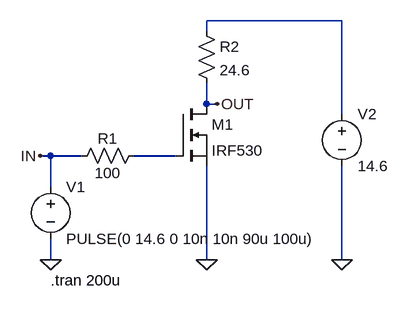
[diagram p0: schematic praca impulsowa e-mosfet.asc]
praca impulsowa e-mosfet.asc, the LTspice schematic file:
Version 4.1
SHEET 1 880 680
WIRE 416 -32 208 -32
WIRE 208 -16 208 -32
WIRE 208 96 208 64
WIRE 224 96 208 96
WIRE 416 112 416 -32
WIRE -32 176 -48 176
WIRE 16 176 -32 176
WIRE 160 176 96 176
WIRE -32 224 -32 176
WIRE -32 336 -32 304
WIRE 208 336 208 192
WIRE 416 336 416 192
FLAG 208 336 0
FLAG -32 336 0
FLAG 416 336 0
FLAG -48 176 IN
FLAG 224 96 OUT
SYMBOL nmos 160 96 R0
SYMATTR InstName M1
SYMATTR Value IRF530
SYMBOL voltage -32 208 R0
WINDOW 123 0 0 Left 0
WINDOW 39 0 0 Left 0
SYMATTR InstName V1
SYMATTR Value PULSE(0 14.6 0 10n 10n 90u 100u)
SYMBOL voltage 416 96 R0
WINDOW 123 0 0 Left 0
WINDOW 39 0 0 Left 0
SYMATTR InstName V2
SYMATTR Value 14.6
SYMBOL res 112 160 R90
WINDOW 0 5 56 VBottom 2
WINDOW 3 27 56 VTop 2
SYMATTR InstName R1
SYMATTR Value 100
SYMBOL res 192 -32 R0
SYMATTR InstName R2
SYMATTR Value 24.6
TEXT -32 368 Left 2 !.tran 200u

The netlist it stands for:
* praca impulsowa e-mosfet.asc
M1 OUT N002 0 0 IRF530
V1 IN 0 PULSE(0 14.6 0 10n 10n 90u 100u)
V2 N001 0 14.6
R1 N002 IN 100
R2 N001 OUT 24.6
.model NMOS NMOS
.model PMOS PMOS
.lib standard.mos
.tran 200u
.backanno
.end